# Altium schematic sheet PM6680_OCXO.SchDoc
size A4
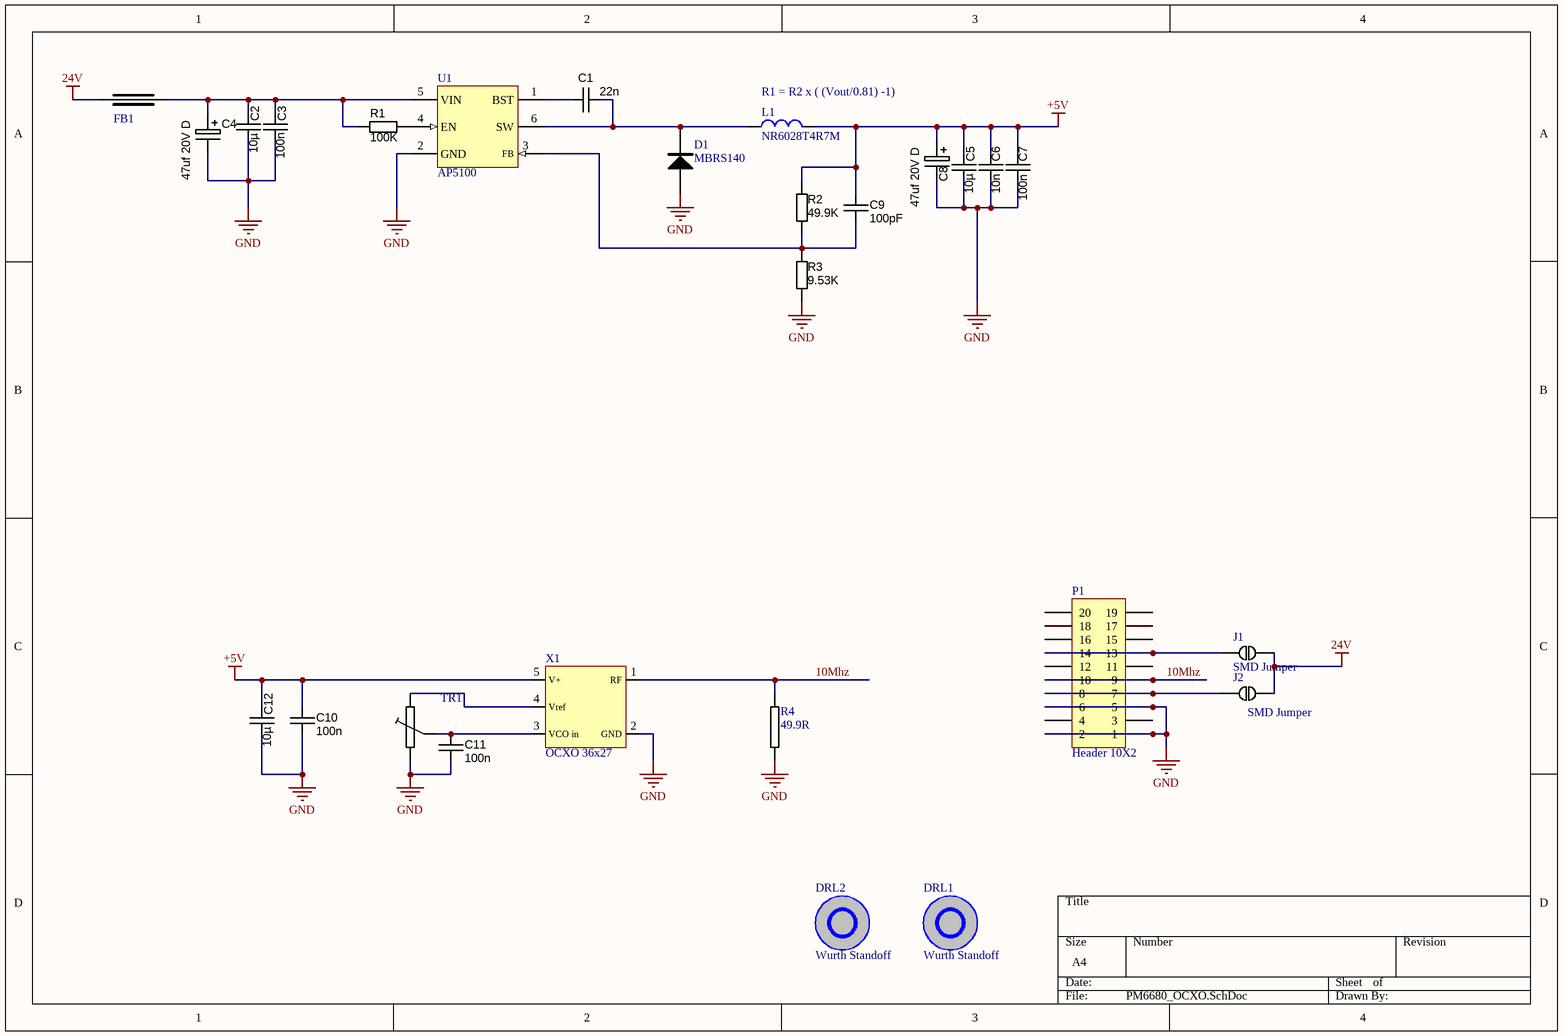
[diagram p0: PM6680_OCXO.SchDoc]

## Parts
C1  22n  [CAPC1608N]
C2  10µ  [CAPC3225N]
C3  100n  [CAPC1608N]
C4  47uf 20V D  [CAPMP7343X310N]
C5  10µ  [CAPC3225N]
C6  10n  [CAPC1608N]
C7  100n  [CAPC1608N]
C8  47uf 20V D  [CAPMP7343X310N]
C9  100pF  [CAPC1608N]
C10  100n  [CAPC1608N]
C11  100n  [CAPC1608N]
C12  10µ  [CAPC3225N]
D1  MBRS140  [DIODE-SMA]
DRL1  Wurth Standoff  [Wurth_PCB_STANDOFF_7740_6mm]
DRL2  Wurth Standoff  [Wurth_PCB_STANDOFF_7740_6mm]
FB1  (no value)  [0805FB-600Z]
J1  SMD Jumper  [SMD_Jumper]
J2  SMD Jumper  [SMD_Jumper]
L1  NR6028T4R7M  [TAIYO_NR6028T4R7M]
P1  Header 10X2  [HDR2X10]
R1  value 100K  [RESC1608N_ZERO]  (hidden comment: Thick Film)
R2  value 49.9K  [RESC1608N_ZERO]  (hidden comment: Thick Film)
R3  value 9.53K  [RESC1608N_ZERO]  (hidden comment: Thick Film)
R4  49.9R  [0805R-5K6]
TR1  (no value)  [TRIMMER-MT]
U1  AP5100  [SOT23-6]
X1  OCXO 36x27  [OCXO_Small]

## Nets
24V: FB1.1 J1.2 J2.2
+5V: C5.1 C6.1 C7.1 C8.1 C9.1 C10.1 C12.1 L1.2 R2.1 X1.5(V+)
GND: C2.2 C3.2 C4.2 C5.2 C6.2 C7.2 C8.2 C10.2 C11.2 C12.2 D1.A P1.1 P1.2 P1.5 P1.6 R3.1 R4.2 TR1.1 U1.2(GND) X1.2(GND)
10Mhz: P1.9 P1.10 R4.1 X1.1(RF)
NetC1_1: C1.1 D1.K L1.1 U1.6(SW)
NetC1_2: C1.2 U1.1(BST)
NetC2_1: C2.1 C3.1 C4.1 FB1.2 R1.1 U1.5(VIN)
NetC9_2: C9.2 R2.2 R3.2 U1.3(FB)
NetC11_1: C11.1 TR1.W X1.3(VCO_in)
NetJ1_1: J1.1 P1.13 P1.14
NetJ2_1: J2.1 P1.7 P1.8
NetR1_2: R1.2 U1.4(EN)
NetTR1_2: TR1.2 X1.4(Vref)

Not connected (* = marked no-connect by the designer): P1 3 4 11 12 15 16 17 18 19 20

## Notes on the sheet
- (near L1) R1 = R2 x ( (Vout/0.81) -1)

## Library data of the parts
C1 C3 C6 C7 C9-C11 = CAPC_10p_0603_NP0_1%_50V: Capacitor SMD Cer 10pF 5% 50V NP0 0603; Manufacturer 1: Murata Electronics North America; Manufacturer Part Number 1: GRM1885C1H100FA01J; Part: C0603X104K5RAC; Ratings: 50V; NP0; Tolerance: ±5%; Operating Temperature: -55°C ~ 125°C; Package / Case: 0603 (1608 Metric); Size / Dimension: 0.063" L x 0.032" W (1.60mm x 0.81mm); Thickness (Max): 0.035" (0.90mm); Supplier 1: Digi-Key; Supplier Part Number 1: GRM1885C1H100FA01J-ND
  C1: Value: 22n
  C3 C7 C10 C11: Value: 100n
  C6: Value: 10n
  C9: Value: 100pF
C2 C5 C12 = CAPC_10u_1210_50V: Capacitor SMD Cer 10uF 20% 16V X5R 1210; Manufacturer 1: Taiyo Yuden; Manufacturer Part Number 1: UMK325BJ106MM-T; Ratings: 50V; X5R; Material: ceramic; Package / Case: 1210 (3225 Metric); Tolerance: ±20%; Size / Dimension: 0.126" L x 0.098" W (3.20mm x 2.50mm); Supplier 1: Digi-Key; Supplier Part Number 1: 587-2225-1-ND; Value: 10µ
C4 C8 = CAPT_330u_2917_6V3: Capacitor SMD Tant 330uF 20% 6V3 2917; Manufacturer Part Number: T520D337M006ATE015; Part: T495D476K020ATE175; Ratings: 6.3V; Material: Solid Tantalum; ESR (Equivalent Series Resistance): 15 mOhm; Package / Case: 2917 (7343 Metric); Tolerance: ±20%; Operating Temperature: -55°C ~ 125°C; Size / Dimension: 0.287" L x 0.169" W (7.30mm x 4.30mm); Height - Seated (Max): 0.122" (3.10mm); Manufacturer Size Code: D; Supplier 1: Digi-Key; Supplier Part Number 1: 399-4052-1-ND; ComponentLink1URL: http://www.kemet.com/datasheets&T520D337M006ATE015; ComponentLink1Description: T520D Datasheet; Value: 47uf 20V D
D1 = MBRS140: DIODE; Supplier 1: Digi-Key; Supplier Part Number 1: MBRS140FSTR-ND
DRL1 DRL2 = PCB_Sandoff: Part: 9774050360
FB1 = 0805FB-600Z: FERRITE BEAD 600 OHM 2A; Part: ILHB0805ER300V; Reel: F5
J1 J2 = SMD_Jumper
L1 = inductor_smd
P1 = Header 10X2: Header, 10-Pin, Dual row; LatestRevisionDate: 17-Jul-2002; LatestRevisionNote: Re-released for DXP Platform.; Publisher: Altium Limited
R1-R3 = RES_0R_0603: Resistor SMD chip 0.0 Ohm 0.1W 0603; Manufacturer 1: Vishay/Dale; Manufacturer Part Number 1: CRCW06030000Z0EA; Tolerance: ±5%; Ratings: 1/10W; Package / Case: 0603 (1608metric); Supplier 1: Digi-Key; Supplier Part Number 1: 541-0.0GCT-ND
R4 = 0805R-5K6: RESISTOR 0805 1/4 WATT THIN FILM; Part: RK73H2ATTD2150F; Reel: *
TR1 = THTRIM-GENERIC: TRIMMABLE RESISTOR; Part: T93XA103KT20
X1 = OCXO_Small_Bliey_6891_isotemp_ocxo131: Part: CTS 970